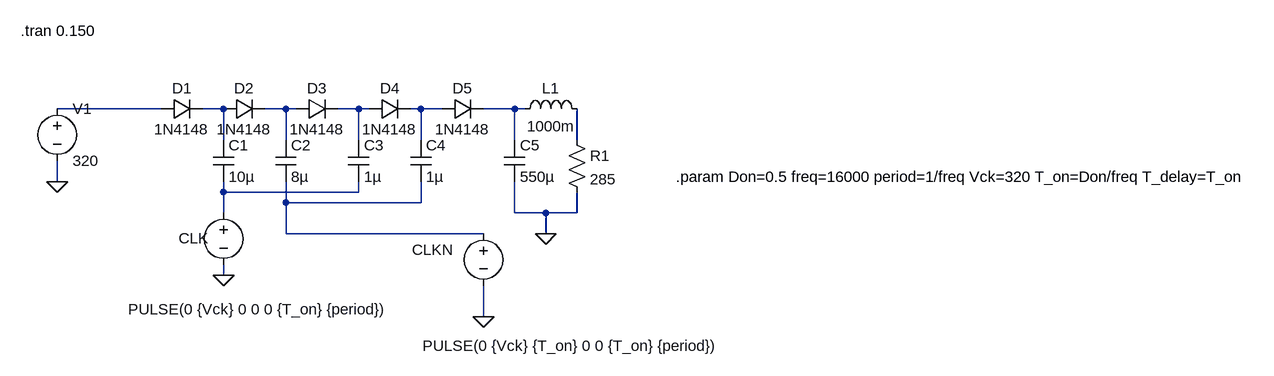
[diagram p0: schematic SweepDickson.asc]
SweepDickson.asc, the LTspice schematic file:
Version 4
SHEET 1 1908 680
WIRE 128 32 -32 32
WIRE 224 32 192 32
WIRE 320 32 288 32
WIRE 336 32 320 32
WIRE 432 32 400 32
WIRE 448 32 432 32
WIRE 528 32 512 32
WIRE 560 32 528 32
WIRE 672 32 624 32
WIRE 688 32 672 32
WIRE 224 80 224 32
WIRE 320 80 320 32
WIRE 432 80 432 32
WIRE 528 80 528 32
WIRE 672 80 672 32
WIRE 768 80 768 32
WIRE -32 144 -32 112
WIRE 224 160 224 144
WIRE 432 160 432 144
WIRE 432 160 224 160
WIRE 320 176 320 144
WIRE 528 176 528 144
WIRE 528 176 320 176
WIRE 224 192 224 160
WIRE 672 192 672 144
WIRE 720 192 672 192
WIRE 768 192 768 160
WIRE 768 192 720 192
WIRE 320 224 320 176
WIRE 624 224 320 224
WIRE 720 224 720 192
WIRE 224 288 224 272
WIRE 624 352 624 304
FLAG 720 224 0
FLAG -32 144 0
FLAG 224 288 0
FLAG 624 352 0
SYMBOL voltage -32 16 R0
WINDOW 123 0 0 Left 0
WINDOW 39 0 0 Left 0
SYMATTR InstName V1
SYMATTR Value 320
SYMBOL voltage 224 176 R0
WINDOW 123 0 0 Left 0
WINDOW 39 0 0 Left 0
WINDOW 0 -69 55 Left 2
WINDOW 3 -147 164 Left 2
SYMATTR InstName CLK
SYMATTR Value PULSE(0 {Vck} 0 0 0 {T_on} {period})
SYMBOL voltage 624 208 R0
WINDOW 123 0 0 Left 0
WINDOW 39 0 0 Left 0
WINDOW 0 -110 41 Left 2
WINDOW 3 -94 188 Left 2
SYMATTR InstName CLKN
SYMATTR Value PULSE(0 {Vck} {T_on} 0 0 {T_on} {period})
SYMBOL diode 128 48 R270
WINDOW 0 32 32 VTop 2
WINDOW 3 0 32 VBottom 2
SYMATTR InstName D1
SYMATTR Value 1N4148
SYMBOL diode 224 48 R270
WINDOW 0 32 32 VTop 2
WINDOW 3 0 32 VBottom 2
SYMATTR InstName D2
SYMATTR Value 1N4148
SYMBOL diode 336 48 R270
WINDOW 0 32 32 VTop 2
WINDOW 3 0 32 VBottom 2
SYMATTR InstName D3
SYMATTR Value 1N4148
SYMBOL diode 448 48 R270
WINDOW 0 32 32 VTop 2
WINDOW 3 0 32 VBottom 2
SYMATTR InstName D4
SYMATTR Value 1N4148
SYMBOL diode 560 48 R270
WINDOW 0 32 32 VTop 2
WINDOW 3 0 32 VBottom 2
SYMATTR InstName D5
SYMATTR Value 1N4148
SYMBOL cap 208 80 R0
SYMATTR InstName C1
SYMATTR Value 10µ
SYMBOL cap 304 80 R0
SYMATTR InstName C2
SYMATTR Value 8µ
SYMBOL cap 416 80 R0
SYMATTR InstName C3
SYMATTR Value 1µ
SYMBOL cap 512 80 R0
SYMATTR InstName C4
SYMATTR Value 1µ
SYMBOL cap 656 80 R0
SYMATTR InstName C5
SYMATTR Value 550µ
SYMBOL res 752 64 R0
SYMATTR InstName R1
SYMATTR Value 285
SYMBOL ind 672 48 R270
WINDOW 0 32 56 VTop 2
WINDOW 3 5 56 VBottom 2
SYMATTR InstName L1
SYMATTR Value 1000m
TEXT -88 -88 Left 2 !.tran 0.150
TEXT 920 136 Left 2 !.param Don=0.5 freq=16000 period=1/freq Vck=320 T_on=Don/freq T_delay=T_on

The netlist it stands for:
* SweepDickson.asc
V1 N001 0 320
V§CLK N008 0 PULSE(0 {Vck} 0 0 0 {T_on} {period})
V§CLKN N009 0 PULSE(0 {Vck} {T_on} 0 0 {T_on} {period})
D1 N001 N002 1N4148
D2 N002 N003 1N4148
D3 N003 N004 1N4148
D4 N004 N005 1N4148
D5 N005 N006 1N4148
C1 N002 N008 10µ
C2 N003 N009 8µ
C3 N004 N008 1µ
C4 N005 N009 1µ
C5 N006 0 550µ
R1 N007 0 285
L1 N006 N007 1000m
.model D D
.lib standard.dio
.tran 0.150
.param Don=0.5 freq=16000 period=1/freq Vck=320 T_on=Don/freq T_delay=T_on
.backanno
.end